# Altium schematic sheet Schematic.SchDoc
size 304 x 205 mm; SheetNumber: 1; SheetTotal: 1
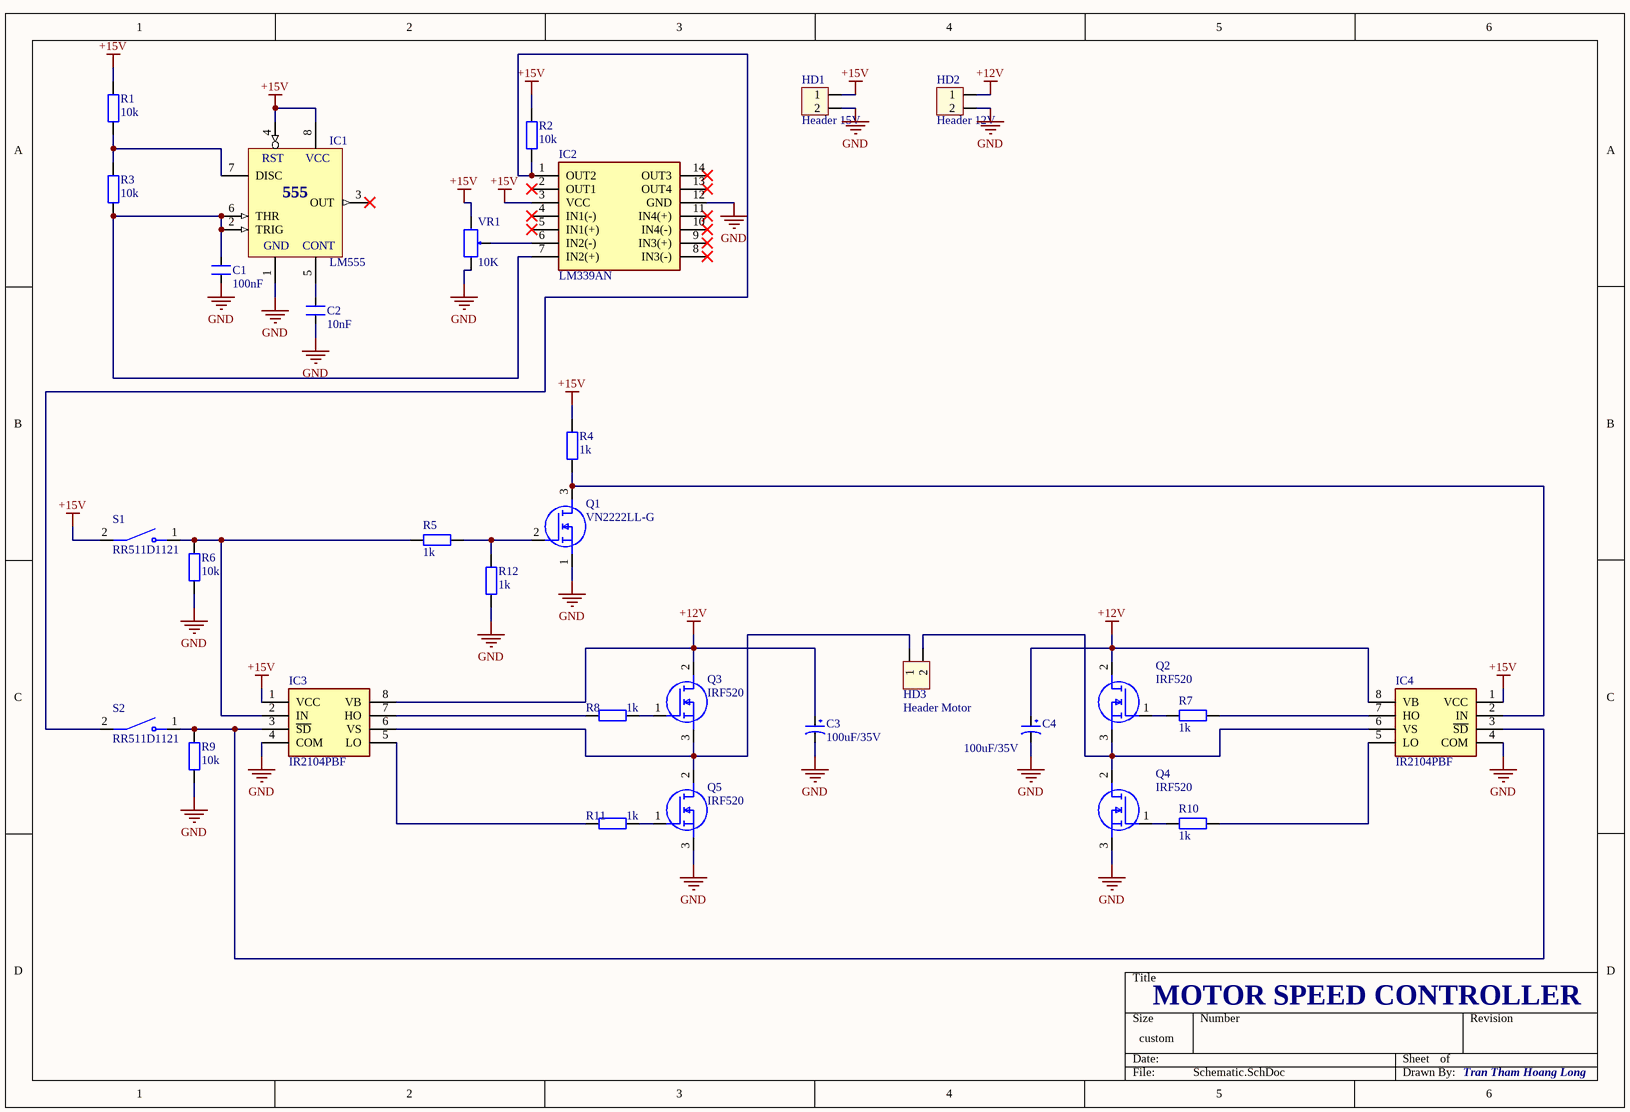
[diagram p0: Schematic.SchDoc]

## Parts
C1  100nF  [CN1]
C2  10nF  [CN1]
C3  100uF/35V  [CP1.5/3.4]
C4  100uF/35V  [CP1.5/3.4]
HD1  Header 15V  [HED2]
HD2  Header 12V  [HED2]
HD3  Header Motor  [HED2]
IC1  LM555  [DIP8/W0.3]
IC2  LM339AN  [DIP794W56P254L1918H533Q14N]
IC3  IR2104PBF  [DIP762W56P254L988H533Q8N]
IC4  IR2104PBF  [DIP762W56P254L988H533Q8N]
Q1  VN2222LL-G  [QTO-92A]
Q2  IRF520  [QTO-220H3]
Q3  IRF520  [QTO-220H3]
Q4  IRF520  [QTO-220H3]
Q5  IRF520  [QTO-220H3]
R1  10k  [R1/4W]
R2  10k  [R1/4W]
R3  10k  [R1/4W]
R4  1k  [R1/4W]
R5  1k  [R1/4W]
R6  10k  [R1/4W]
R7  1k  [R1/4W]
R8  1k  [R1/4W]
R9  10k  [R1/4W]
R10  1k  [R1/4W]
R11  1k  [R1/4W]
R12  1k  [R1/4W]
S1  RR511D1121  [E-SWITCH_RR511D1121]
S2  RR511D1121  [E-SWITCH_RR511D1121]
VR1  10K  [VOL_1]

## Nets
+12V: C3.1 C4.1 HD2.1 IC3.8(VB) IC4.8(VB) Q2.2(D) Q3.2(D)
+15V: HD1.1 IC1.4(RST) IC1.8(VCC) IC2.3(VCC) IC3.1(VCC) IC4.1(VCC) R1.2 R2.2 R4.1 S1.2(COM) VR1.1
GND: C1.1 C2.1 C3.2 C4.2 HD1.2 HD2.2 IC1.1(GND) IC2.12(GND) IC3.4(COM) IC4.4(COM) Q1.1(S) Q4.3(S) Q5.3(S) R6.1 R9.1 R12.2 VR1.3
NetC1_2: C1.2 IC1.2(TRIG) IC1.6(THR) IC2.7(IN2(+)) R3.1
NetC2_2: C2.2 IC1.5(CONT)
NetHD3_1: HD3.1 IC3.6(VS) Q3.3(S) Q5.2(D)
NetHD3_2: HD3.2 IC4.6(VS) Q2.3(S) Q4.2(D)
NetIC1_7: IC1.7(DISC) R1.1 R3.2
NetIC2_1: IC2.1(OUT2) R2.1 S2.2(COM)
NetIC2_6: IC2.6(IN2(-)) VR1.2
NetIC3_2: IC3.2(IN) R5.2 R6.2 S1.1(NO)
NetIC3_3: IC3.3(~{SD}) IC4.3(~{SD}) R9.2 S2.1(NO)
NetIC3_5: IC3.5(LO) R11.2
NetIC3_7: IC3.7(HO) R8.2
NetIC4_2: IC4.2(IN) Q1.3(D) R4.2
NetIC4_5: IC4.5(LO) R10.2
NetIC4_7: IC4.7(HO) R7.2
NetQ1_2: Q1.2(G) R5.1 R12.1
NetQ2_1: Q2.1(G) R7.1
NetQ3_1: Q3.1(G) R8.1
NetQ4_1: Q4.1(G) R10.1
NetQ5_1: Q5.1(G) R11.1

Not connected (* = marked no-connect by the designer): IC1 3(OUT)*; IC2 2(OUT1)* 4(IN1(-))* 5(IN1(+))* 8(IN3(-))* 9(IN3(+))* 10(IN4(-))* 11(IN4(+))* 13(OUT4)* 14(OUT3)*

## Notes on the sheet
- MOTOR SPEED CONTROLLER
- Tran Tham Hoang Long
- (in symbol LM555) 555

## Library data of the parts
C1 C2 = CN1: Cap np  1pF - 472pF; Value: 100pF
C3 C4 = CP3: Cap 100uF/35V - 470uF/16V; Value: 100uF/35V/50V; Description 1: 1000uF/6,3V - 470uF/16V - 330uF - 25V; Description 2: 220uF/35V - 100uF/50V - 63V - 4,7uF/200V; Description 3: 22uF => 33uF100V - 3,3uF => 4,7uF/250V; Description 4: 2,2uF =>3,3uF/350 - 2,2uF/400V - 1uF/450V
HD1-HD3 = Hed2: Header 2 (Green); Value: Header 2
IC1 = LM555: Timer; Value: LM555
IC2 = LM339AN: Integrated Circuit; Manufacturer_Name: onsemi; Datasheet Link: https://www.onsemi.com/pub/Collateral/LM339A-D.pdf; Height: 5.33mm; Manufacturer_Part_Number: LM339AN; Mouser Part Number: 512-LM339AN; Mouser Price/Stock: https://www.mouser.co.uk/ProductDetail/ON-Semiconductor-Fairchild/LM339AN?qs=r%252BnRUBmG8vwgzPexLRnjyQ%3D%3D; Arrow Part Number: LM339AN; Arrow Price/Stock: https://www.arrow.com/en/products/lm339an/on-semiconductor
IC3 IC4 = IR2104PBF: Integrated Circuit; Manufacturer_Name: Infineon; Datasheet Link: https://www.infineon.com/cms/en/product/power/gate-driver-ics/?; Height: 5.33mm; Manufacturer_Part_Number: IR2104PBF; Mouser Part Number: 942-IR2104PBF; Mouser Price/Stock: https://www.mouser.co.uk/ProductDetail/Infineon-Technologies/IR2104PBF?qs=2r01AXMCG3MRbRuDhWcpKw%3D%3D; Arrow Part Number: IR2104PBF; Arrow Price/Stock: https://www.arrow.com/en/products/ir2104pbf/infineon-technologies-ag?region=nac
Q1 = VN2222LL-G: MOSFET (N-Channel); Manufacturer_Name: Microchip; Datasheet Link: http://www.microchip.com/mymicrochip/filehandler.aspx?ddocname=en571446; Height: 5.334mm; Manufacturer_Part_Number: VN2222LL-G; Mouser Part Number: 689-VN2222LL-G; Mouser Price/Stock: https://www.mouser.co.uk/ProductDetail/Microchip-Technology/VN2222LL-G?qs=H6g4Fy%252BsDGemwmUTAFka1Q%3D%3D; Arrow Part Number: VN2222LL-G; Arrow Price/Stock: https://www.arrow.com/en/products/vn2222ll-g/microchip-technology?region=europe
Q2-Q5 = IRF520: MOSFET (N-Channel); Manufacturer_Name: STMicroelectronics; Datasheet Link: https://eu.mouser.com/datasheet/2/389/stmicroelectronics_cd00000698-1204495.pdf; Height: 4.6mm; Manufacturer_Part_Number: IRF520; Mouser Part Number: 511-IRF520; Mouser Price/Stock: https://www.mouser.co.uk/ProductDetail/STMicroelectronics/IRF520?qs=%2FcnINApUglMqLk371v6AuA%3D%3D
R1-R12 = R1/4W: Resistor 1/4W; Value: R1/4W - 1K
S1 S2 = RR511D1121: Rocker Switch, RR5 Series, SPST,OFF-ON,Blk Rocker,I/O Legend, 20A, 125VAC, QC; MF: E-Switch; Check_prices: https://www.snapeda.com/parts/RR511D1121/E-Switch/view-part/?ref=eda; Value: *; Availability: In Stock; MP: RR511D1121; Price: None; Package: None; SnapEDA_Link: https://www.snapeda.com/parts/RR511D1121/E-Switch/view-part/?ref=snap; Purchase-URL: https://pricing.snapeda.com/search/part/RR511D1121/?ref=eda
VR1 = Var Resitor: Var Resistor; Value: VR 10K